# EAGLE design sodaled (EAGLE 6.3)
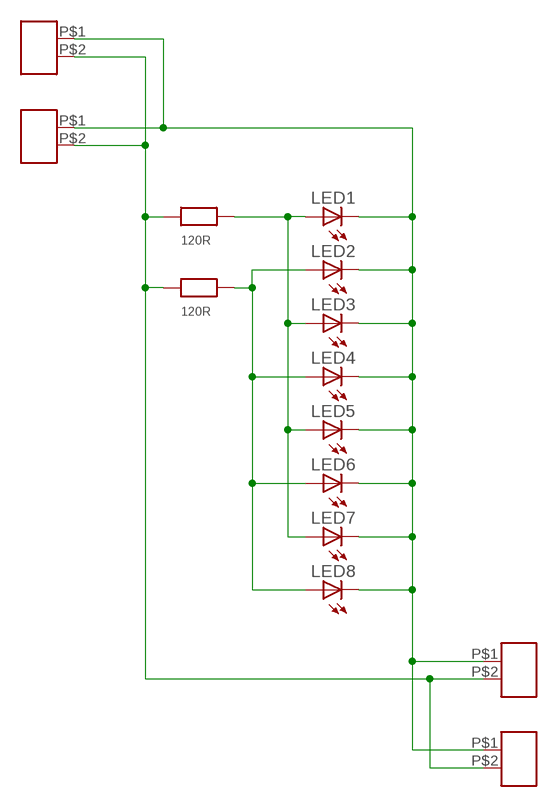
[diagram p0: schematic, sheet 1]

## Parts
LED1  LEDRECT_SIDE  [LED_RECT_SIDEMOUNT]
LED2  LEDRECT_SIDE  [LED_RECT_SIDEMOUNT]
LED3  LEDRECT_SIDE  [LED_RECT_SIDEMOUNT]
LED4  LEDRECT_SIDE  [LED_RECT_SIDEMOUNT]
LED5  LEDRECT_SIDE  [LED_RECT_SIDEMOUNT]
LED6  LEDRECT_SIDE  [LED_RECT_SIDEMOUNT]
LED7  LEDRECT_SIDE  [LED_RECT_SIDEMOUNT]
LED8  LEDRECT_SIDE  [LED_RECT_SIDEMOUNT]
U$1  M02  [1X02]
U$2  M02  [1X02]
U$3  M02  [1X02]
U$4  M02  [1X02]
U$7  120R  RESISTOR  [RESISTOR_CFM1]
U$8  120R  RESISTOR  [RESISTOR_CFM1]

## Nets
7.4V: U$1.P$2 U$2.P$2 U$3.P$2 U$4.P$2 U$7.P$1 U$8.P$1
GND: LED1.C LED2.C LED3.C LED4.C LED5.C LED6.C LED7.C LED8.C U$1.P$1 U$2.P$1 U$3.P$1 U$4.P$1
N$2: LED1.A LED3.A LED5.A LED7.A U$7.P$2
N$3: LED2.A LED4.A LED6.A LED8.A U$8.P$2

## Library data of the parts
LED1-LED8 = tiago:LED: LEDs Standard schematic elements and footprints for 5mm, 3mm, 1206, and 0603 sized LEDs. 5mm - Spark Fun Electronics SKU : COM-00529 (and others)
U$1-U$4 = tiago:M02
U$7 U$8 = tiago:RESISTOR

## Board
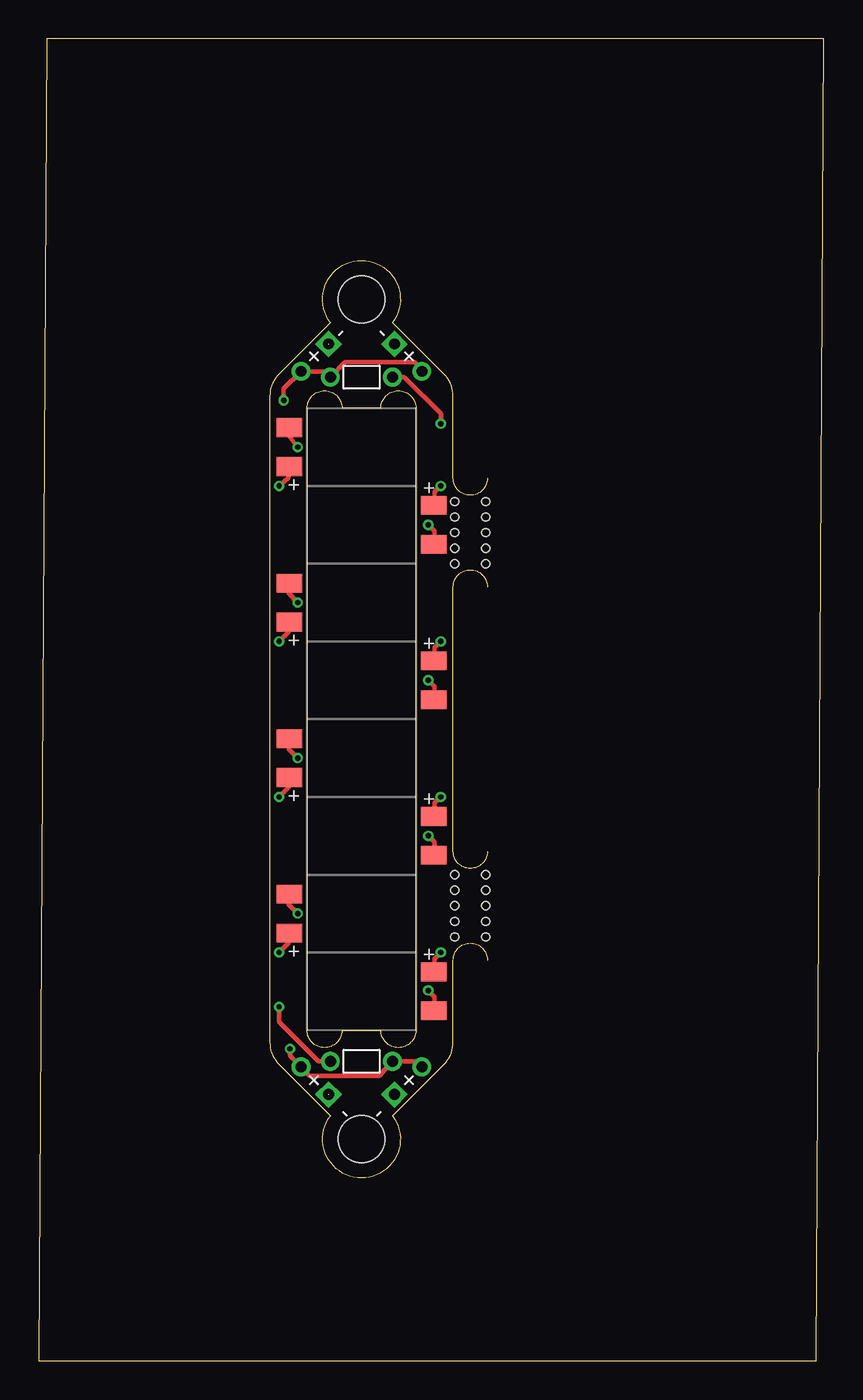
[diagram p1: board, top side]
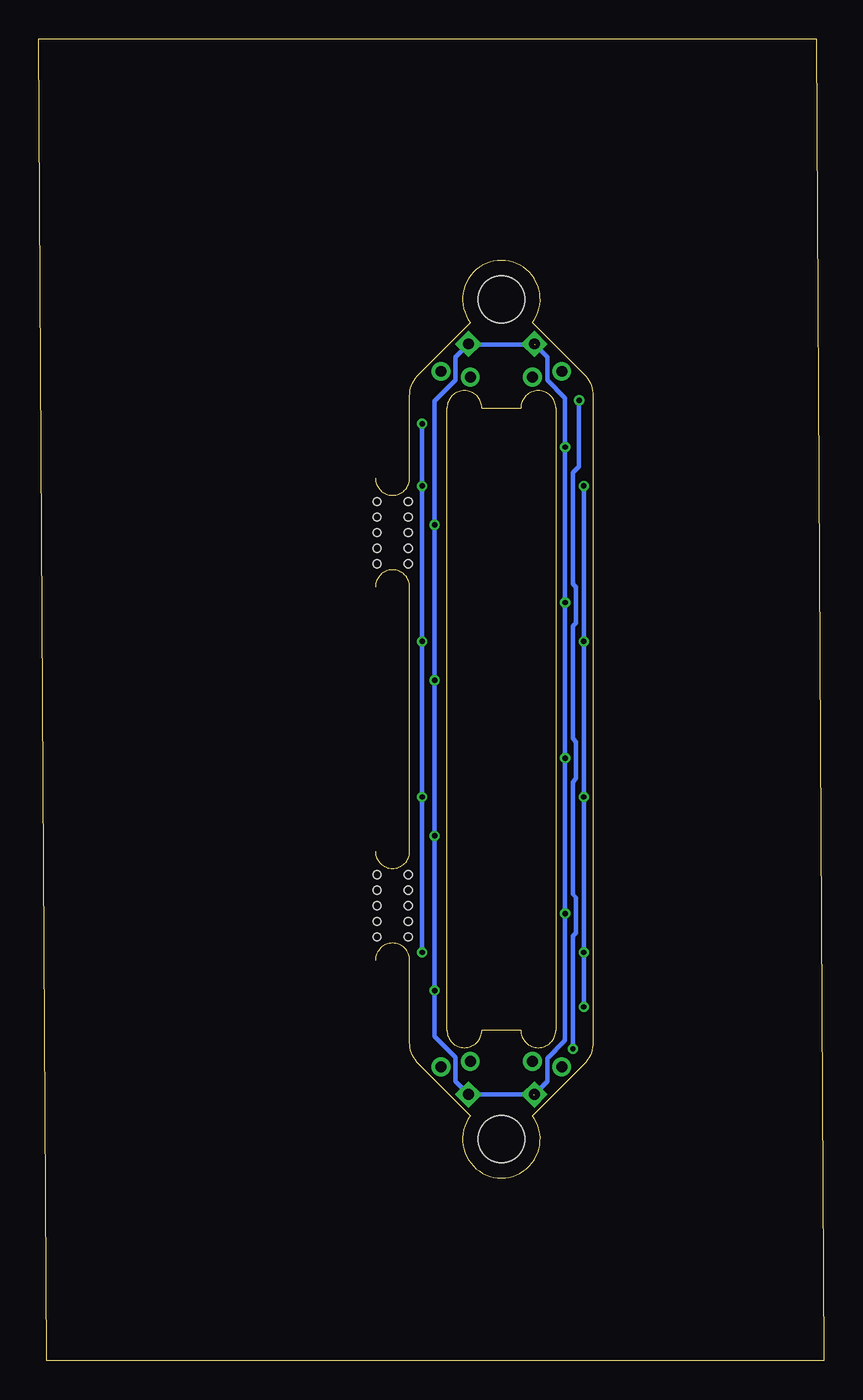
[diagram p2: board, bottom side, seen from below]

Size 50.5 x 85 mm. Coordinates in mm from the lower left corner, seen from the top.
Outline: 28.85,25.75 arc180 26.65,25.75 26.65,20.48 arc-45 26.06,19.06 22.75,15.75 arc-254 18.75,15.75 15.44,19.06 arc-45 14.85,20.48 14.85,62.02 arc-45 15.44,63.44 18.75,66.75 arc-254 22.75,66.75 26.06,63.44 arc-45 26.65,62.02 26.65,56.75 arc180 28.85,56.75
Outline: 28.85,32.75 arc-180 26.65,32.75 26.65,49.75 arc-180 28.85,49.75
Outline: 0,0 50,0 50.5,85 0.5,85 0,0
Outline: 17.25,61.25 17.25,21.25 arc180 19.5,21.25 22,21.25 arc180 24.25,21.25 24.25,61.25 arc180 22,61.25 19.5,61.25 arc180 17.25,61.25
Copper layers (1*16): Top 0.035mm / dielectric 1.5mm / Bottom 0.035mm
Design rules "ITEADstudio_DRC": minimum track width 6mil, minimum drill 12mil, track to track 6mil, track to pad 6mil, pad to pad 6mil, via to via 6mil, smd to smd 0mil, copper to edge 10mil, drill to drill 10mil, minimum pad ring 10mil, minimum via ring 6mil, stop-mask expansion 2mil, vias tented up to drill 100mil, thermal gap 10mil
Holes 3 mm at 20.75,14.25 20.75,68.25
Holes 0.5 mm at 26.75,27.25 26.75,28.25 26.75,29.25 26.75,30.25 26.75,31.25 28.75,27.25 28.75,28.25 28.75,29.25 28.75,30.25 28.75,31.25 26.75,51.25 26.75,52.25 26.75,53.25 26.75,54.25 26.75,55.25 28.75,51.25 28.75,52.25 28.75,53.25 28.75,54.25 28.75,55.25

### Footprints (pad centres in the part's own frame; a part is rotated, then mirrored left to right if it is on the bottom)
LED_RECT_SIDEMOUNT = smd 1.65 x 1.2: A -4.65,-1.25; C -4.65,1.25
1X02 = drill 0.7 square: P$1 -1.25,0 | drill 0.7: P$2 1.25,0
RESISTOR_CFM1 = drill 0.7: P$1 2,0; P$2 -2,0

### Placement (x,y rotation side)
LED1  20.75,58.75 0 top
LED2  20.75,53.75 180 top
LED3  20.75,48.75 0 top
LED4  20.75,43.75 180 top
LED5  20.75,38.75 0 top
LED6  20.75,33.75 180 top
LED7  20.75,28.75 0 top
LED8  20.75,23.75 180 top
U$1  17.75,18 135 top
U$2  23.75,18 45 top
U$3  17.75,64.5 225 top
U$4  23.75,64.5 315 top
U$7  20.75,19.25 0 top
U$8  20.75,63.25 180 top

### Tracks (layer width: path | path; a pad name or v marks a point on that pad's centre or on a via)
7.4V  (via drill 0.35)
  Top 0.305: v15.75,61.75 15.75,62.5 U$3.P$2 18.28,63.62 U$8.P$1 19.7,64.2 24.15,64.2 24.63,63.72 U$4.P$2 | v16.15,20.05 16.15,19.6 U$1.P$2 17.4,18.3 21.9,18.3 22.75,19.3 U$7.P$1 24.27,19.25 U$2.P$2
  Bottom 0.305: v15.75,61.75 15.75,57.5 16.15,57.1 16.15,49.95 15.95,49.75 15.95,47.45 16.15,47.25 16.15,40 15.95,39.8 15.95,37.45 16.15,37.2 16.15,30 15.95,29.75 15.95,27.5 16.15,27.3 v16.15,20.05
GND  (via drill 0.35)  (2 unrouted)
  Top 0.305: LED1.C 16.1,59.45 v16.65,58.75 | LED3.C 16.05,49.35 v16.65,48.75 | LED5.C 16.05,39.35 v16.65,38.75 | LED7.C 16.05,29.35 v16.65,28.75 | LED2.C 25.45,53.35 v25.05,53.75 | LED4.C 25.45,43.35 v25.05,43.75 | LED6.C 25.45,33.35 v25.05,33.75 | LED8.C 25.45,23.4 v25.05,23.8
  Bottom 0.305: U$1.P$1 17.8,17.95 17.8,19.45 16.65,20.6 v16.65,28.75 v16.65,38.75 v16.65,48.75 v16.65,58.75 16.65,61.9 17.8,63.05 17.8,64.55 U$3.P$1 | U$4.P$1 23.7,64.55 23.7,63.05 25.05,61.7 v25.05,53.75 v25.05,43.75 v25.05,33.75 v25.05,23.8 25.05,20.85 23.7,19.5 23.7,17.95 U$2.P$1 18.67,17.12 18.65,17.1 | 22.9,65.35 18.6,65.35
N$2  (via drill 0.35)
  Top 0.305: LED1.A 16.05,56.8 v15.45,56.25 | LED3.A 16.05,46.85 v15.45,46.25 | LED5.A 16.05,36.85 v15.45,36.25 | LED7.A 16.05,26.85 v15.45,26.25 | U$7.P$2 18,19.25 15.45,21.8 v15.45,22.75
  Bottom 0.305: v15.45,56.25 v15.45,46.25 v15.45,36.25 v15.45,26.25 v15.45,22.75
N$3  (via drill 0.35)
  Top 0.305: U$8.P$2 23.5,63.25 25.85,60.9 v25.85,60.25 | LED2.A 25.45,55.85 v25.85,56.25 | LED6.A 25.45,35.85 v25.85,36.25 | LED4.A 25.45,45.85 v25.85,46.25 | LED8.A 25.45,25.85 v25.85,26.25
  Bottom 0.305: v25.85,60.25 v25.85,56.25 v25.85,46.25 v25.85,36.25 v25.85,26.25

### Text on the board
tPlace: - | - | + | + | + | + | - | -